# Altium schematic sheet SchematicPorts.SchDoc
size A4; DocumentNumber: 3; SheetNumber: 3; SheetTotal: 4
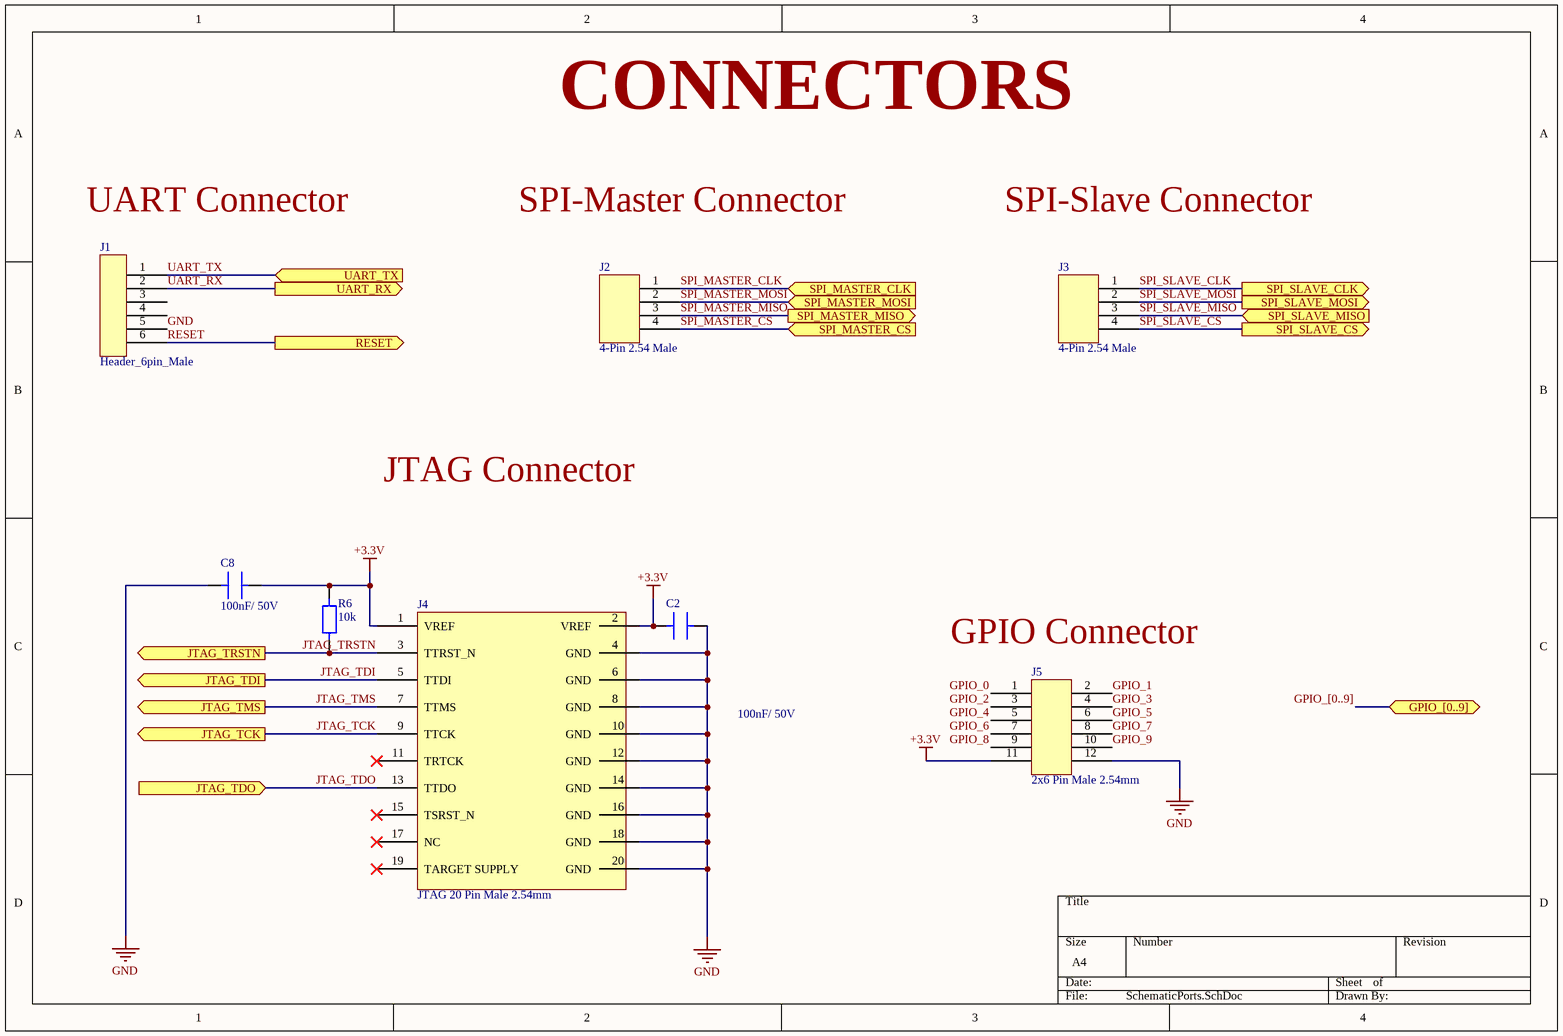
[diagram p0: SchematicPorts.SchDoc]

## Parts
C2  100nF/ 50V  [C0603]
C8  100nF/ 50V  [C0603]
J1  Header_6pin_Male  [Header_6pin_male]
J2  4-Pin 2.54 Male  [DIP4 4X1 Pitch 2.54mm]
J3  4-Pin 2.54 Male  [DIP4 4X1 Pitch 2.54mm]
J4  JTAG 20 Pin Male 2.54mm  [JTAG 20-Pin]
J5  2x6 Pin Male 2.54mm  [DIP12 2X6 Pitch 2.54mm]
R6  10k  [R0603]

## Ports
GPIO_[0..9] (bidir), JTAG_TCK (out), JTAG_TDI (out), JTAG_TDO (in), JTAG_TMS (out), JTAG_TRSTN (out), RESET (out), SPI_MASTER_CLK (in), SPI_MASTER_CS (in), SPI_MASTER_MISO (out), SPI_MASTER_MOSI (in), SPI_SLAVE_CLK (out), SPI_SLAVE_CS (out), SPI_SLAVE_MISO (in), SPI_SLAVE_MOSI (out), UART_RX (out), UART_TX (in)

## Nets
+3.3V: C2.2 C8.1 J4.1(VREF) J4.2(VREF) J5.11 R6.2
GND: C2.1 C8.2 J1.5 J4.4(GND) J4.6(GND) J4.8(GND) J4.10(GND) J4.12(GND) J4.14(GND) J4.16(GND) J4.18(GND) J4.20(GND) J5.12
GPIO_0: J5.1
GPIO_1: J5.2
GPIO_2: J5.3
GPIO_3: J5.4
GPIO_4: J5.5
GPIO_5: J5.6
GPIO_6: J5.7
GPIO_7: J5.8
GPIO_8: J5.9
GPIO_9: J5.10
JTAG_TCK: J4.9(TTCK) ; port JTAG_TCK
JTAG_TDI: J4.5(TTDI) ; port JTAG_TDI
JTAG_TDO: J4.13(TTDO) ; port JTAG_TDO
JTAG_TMS: J4.7(TTMS) ; port JTAG_TMS
JTAG_TRSTN: J4.3(TTRST_N) R6.1 ; port JTAG_TRSTN
RESET: J1.6 ; port RESET
SPI_MASTER_CLK: J2.1 ; port SPI_MASTER_CLK
SPI_MASTER_CS: J2.4 ; port SPI_MASTER_CS
SPI_MASTER_MISO: J2.3 ; port SPI_MASTER_MISO
SPI_MASTER_MOSI: J2.2 ; port SPI_MASTER_MOSI
SPI_SLAVE_CLK: J3.1 ; port SPI_SLAVE_CLK
SPI_SLAVE_CS: J3.4 ; port SPI_SLAVE_CS
SPI_SLAVE_MISO: J3.3 ; port SPI_SLAVE_MISO
SPI_SLAVE_MOSI: J3.2 ; port SPI_SLAVE_MOSI
UART_RX: J1.2 ; port UART_RX
UART_TX: J1.1 ; port UART_TX

Not connected (* = marked no-connect by the designer): J1 3 4; J4 11(TRTCK)* 15(TSRST_N)* 17(NC)* 19(TARGET_SUPPLY)*

## Buses and harness runs
bus GPIO_[0..9] = port GPIO_[0..9]

## Notes on the sheet
- CONNECTORS
- UART Connector
- SPI-Master Connector
- SPI-Slave Connector
- JTAG Connector
- (near J5) GPIO Connector

## Library data of the parts
C2 C8 = C 100nF/ 50V: C0603/C0805
J2 J3 = Molex 90120-0124 1x4 Pin Male 2.54mm
J4 = JTAG 20-Pin 2.54 ARM USB-Tiny H
J5 = Molex 90131-1086 2x6 PIn Header_1
R6 = RES_10k: 0805